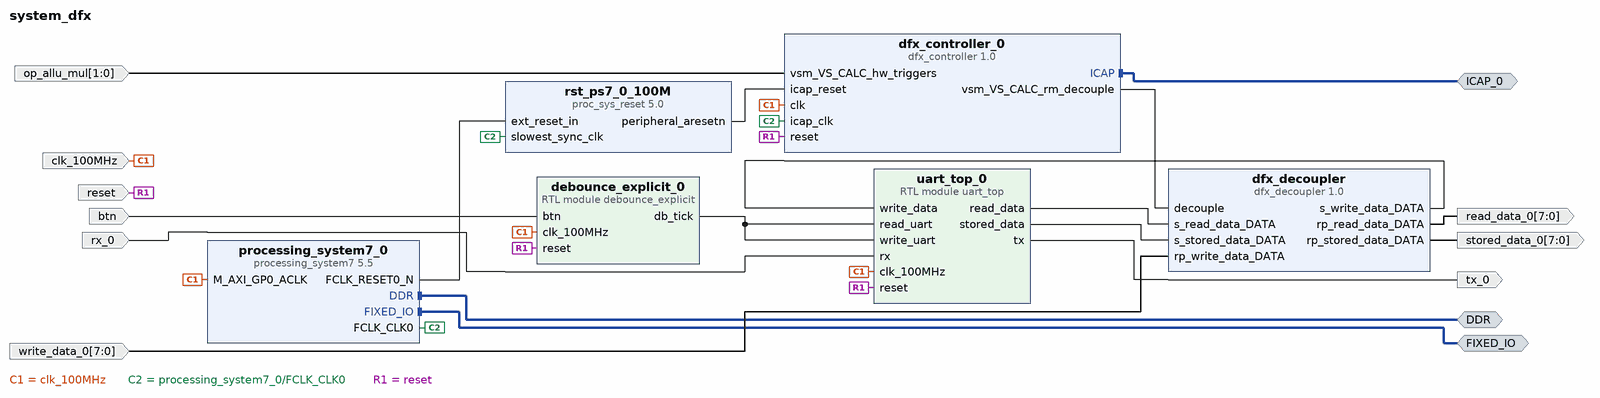
[diagram p0: block diagram of the top level]
# Vivado block design system_dfx, xc7z020clg400-1, Vivado 2024.2
create_bd_design system_dfx

create_bd_intf_port -mode Master -vlnv xilinx.com:interface:ddrx_rtl:1.0 DDR
create_bd_intf_port -mode Master -vlnv xilinx.com:display_processing_system7:fixedio_rtl:1.0 FIXED_IO
create_bd_intf_port -mode Master -vlnv xilinx.com:interface:icap_rtl:1.0 ICAP_0
create_bd_port -dir I -type rst reset
create_bd_port -dir I clk_100MHz
create_bd_port -dir I btn
create_bd_port -dir I rx_0
create_bd_port -dir I -from 7 -to 0 write_data_0
create_bd_port -dir O tx_0
create_bd_port -dir O -from 7 -to 0 read_data_0
create_bd_port -dir O -from 7 -to 0 stored_data_0
create_bd_port -dir I -from 1 -to 0 op_allu_mul

create_bd_cell -type ip -vlnv xilinx.com:ip:processing_system7:5.5 processing_system7_0
set_property -dict [list \
  CONFIG.PCW_APU_PERIPHERAL_FREQMHZ 650 \
  CONFIG.PCW_CRYSTAL_PERIPHERAL_FREQMHZ 50 \
  CONFIG.PCW_ENET0_ENET0_IO {MIO 16 .. 27} \
  CONFIG.PCW_ENET0_GRP_MDIO_ENABLE 1 \
  CONFIG.PCW_ENET0_GRP_MDIO_IO {MIO 52 .. 53} \
  CONFIG.PCW_ENET0_PERIPHERAL_ENABLE 1 \
  CONFIG.PCW_ENET0_RESET_ENABLE 1 \
  CONFIG.PCW_ENET0_RESET_IO {MIO 9} \
  CONFIG.PCW_ENET_RESET_ENABLE 1 \
  CONFIG.PCW_ENET_RESET_SELECT {Share reset pin} \
  CONFIG.PCW_FPGA0_PERIPHERAL_FREQMHZ 100 \
  CONFIG.PCW_FPGA1_PERIPHERAL_FREQMHZ 50 \
  CONFIG.PCW_GPIO_MIO_GPIO_ENABLE 1 \
  CONFIG.PCW_GPIO_MIO_GPIO_IO MIO \
  CONFIG.PCW_I2C_RESET_ENABLE 1 \
  CONFIG.PCW_M_AXI_GP0_FREQMHZ 10 \
  CONFIG.PCW_PERIPHERAL_BOARD_PRESET None \
  CONFIG.PCW_PRESET_BANK1_VOLTAGE {LVCMOS 1.8V} \
  CONFIG.PCW_QSPI_GRP_FBCLK_ENABLE 1 \
  CONFIG.PCW_QSPI_GRP_FBCLK_IO {MIO 8} \
  CONFIG.PCW_QSPI_GRP_SINGLE_SS_ENABLE 1 \
  CONFIG.PCW_QSPI_GRP_SINGLE_SS_IO {MIO 1 .. 6} \
  CONFIG.PCW_QSPI_PERIPHERAL_ENABLE 1 \
  CONFIG.PCW_QSPI_QSPI_IO {MIO 1 .. 6} \
  CONFIG.PCW_SD0_GRP_CD_ENABLE 1 \
  CONFIG.PCW_SD0_GRP_CD_IO {MIO 47} \
  CONFIG.PCW_SD0_GRP_WP_ENABLE 0 \
  CONFIG.PCW_SD0_PERIPHERAL_ENABLE 1 \
  CONFIG.PCW_SD0_SD0_IO {MIO 40 .. 45} \
  CONFIG.PCW_SDIO_PERIPHERAL_FREQMHZ 50 \
  CONFIG.PCW_SINGLE_QSPI_DATA_MODE x4 \
  CONFIG.PCW_UART0_PERIPHERAL_ENABLE 1 \
  CONFIG.PCW_UART0_UART0_IO {MIO 14 .. 15} \
  CONFIG.PCW_UART1_PERIPHERAL_ENABLE 0 \
  CONFIG.PCW_UART_PERIPHERAL_FREQMHZ 100 \
  CONFIG.PCW_UIPARAM_DDR_BUS_WIDTH {16 Bit} \
  CONFIG.PCW_UIPARAM_DDR_FREQ_MHZ 525 \
  CONFIG.PCW_UIPARAM_DDR_PARTNO {MT41J256M16 RE-125} \
  CONFIG.PCW_USB0_PERIPHERAL_ENABLE 1 \
  CONFIG.PCW_USB0_RESET_ENABLE 1 \
  CONFIG.PCW_USB0_RESET_IO {MIO 46} \
  CONFIG.PCW_USB0_USB0_IO {MIO 28 .. 39} \
  CONFIG.PCW_USB_RESET_ENABLE 1 \
  CONFIG.PCW_USB_RESET_SELECT {Share reset pin} \
] [get_bd_cells processing_system7_0]
# 481 more settings of processing_system7_0 are not shown: defaults, MIO pin electricals, DDR timing, and values the tool derives
create_bd_cell -type ip -vlnv xilinx.com:ip:dfx_decoupler:1.0 dfx_decoupler
set_property -dict [list \
  CONFIG.ALL_PARAMS {['INTF {', 'read_data {ID 0 VLNV xilinx.com:signal:data_rtl:1.0 SIGNALS {DATA {MANAGEMENT manual WIDTH 8}} MODE slave} stored_data {ID 1 VLNV xilinx.com:signal:data_rtl:1.0 MODE slave SIGNALS {DATA {MANAGEMENT', 'manual WIDTH 8}}} write_data {ID 2 VLNV xilinx.com:signal:data_rtl:1.0 SIGNALS {DATA {MANAGEMENT manual WIDTH 8}}}', '}']} \
  CONFIG.GUI_INTERFACE_NAME read_data \
  CONFIG.GUI_SELECT_VLNV xilinx.com:signal:data_rtl:1.0 \
  CONFIG.GUI_SIGNAL_MANAGEMENT_0 manual \
  CONFIG.GUI_SIGNAL_WIDTH_0 8 \
] [get_bd_cells dfx_decoupler]
create_bd_cell -type ip -vlnv xilinx.com:ip:dfx_controller:1.0 dfx_controller_0
set_property -dict [list \
  CONFIG.ALL_PARAMS {['HAS_AXI_LITE_IF 1', 'RESET_ACTIVE_LEVEL 0', 'CP_FIFO_DEPTH 32', 'CP_FIFO_TYPE lutram', 'CDC_STAGES 6', 'VS {', 'VS_CALC {ID 0 NAME VS_CALC RM {RM_ALU {ID 0 NAME RM_ALU BS {0 {ID 0 ADDR 0 SIZE 0 CLEAR 0}} RESET_REQUIRED no} RM_MUL {ID 1 NAME RM_MUL BS {0 {ID 0 ADDR 0 SIZE 0 CLEAR 0}}}} POR_RM RM_ALU', 'START_IN_SHUTDOWN 1 RMS_ALLOCATED 4 NUM_HW_TRIGGERS 2 TRIGGER_TO_RM {0 RM_ALU 1 RM_MUL}}', '}', 'CP_FAMILY 7series', 'DIRTY 1']} \
  CONFIG.GUI_LOCK_TRIGGER_0 true \
  CONFIG.GUI_LOCK_TRIGGER_1 true \
  CONFIG.GUI_RM_NEW_NAME RM_MUL \
  CONFIG.GUI_RM_RESET_REQUIRED no \
  CONFIG.GUI_SELECT_RM 1 \
  CONFIG.GUI_VS_NEW_NAME VS_CALC \
  CONFIG.GUI_VS_NUM_HW_TRIGGERS 2 \
] [get_bd_cells dfx_controller_0]
create_bd_cell -type ip -vlnv xilinx.com:ip:proc_sys_reset:5.0 rst_ps7_0_100M
create_bd_cell -type module -reference debounce_explicit debounce_explicit_0
create_bd_cell -type module -reference uart_top uart_top_0

# ---- connections ----

connect_bd_intf_net [get_bd_intf_ports ICAP_0] [get_bd_intf_pins dfx_controller_0/ICAP]
connect_bd_intf_net [get_bd_intf_ports DDR] [get_bd_intf_pins processing_system7_0/DDR]
connect_bd_intf_net [get_bd_intf_ports FIXED_IO] [get_bd_intf_pins processing_system7_0/FIXED_IO]
connect_bd_net [get_bd_ports btn] [get_bd_pins debounce_explicit_0/btn]
connect_bd_net -net clk_100MHz_0_1 [get_bd_ports clk_100MHz] \
  [get_bd_pins processing_system7_0/M_AXI_GP0_ACLK] [get_bd_pins dfx_controller_0/clk] [get_bd_pins uart_top_0/clk_100MHz] \
  [get_bd_pins debounce_explicit_0/clk_100MHz]
connect_bd_net [get_bd_pins debounce_explicit_0/db_tick] [get_bd_pins uart_top_0/read_uart] [get_bd_pins uart_top_0/write_uart]
connect_bd_net [get_bd_pins dfx_controller_0/vsm_VS_CALC_rm_decouple] [get_bd_pins dfx_decoupler/decouple]
connect_bd_net [get_bd_pins dfx_decoupler/rp_read_data_DATA] [get_bd_ports read_data_0]
connect_bd_net [get_bd_pins dfx_decoupler/rp_stored_data_DATA] [get_bd_ports stored_data_0]
connect_bd_net [get_bd_pins dfx_decoupler/s_write_data_DATA] [get_bd_pins uart_top_0/write_data]
connect_bd_net [get_bd_pins processing_system7_0/FCLK_CLK0] [get_bd_pins dfx_controller_0/icap_clk] [get_bd_pins rst_ps7_0_100M/slowest_sync_clk]
connect_bd_net [get_bd_pins processing_system7_0/FCLK_RESET0_N] [get_bd_pins rst_ps7_0_100M/ext_reset_in]
connect_bd_net -net reset_0_1 [get_bd_ports reset] \
  [get_bd_pins dfx_controller_0/reset] [get_bd_pins uart_top_0/reset] [get_bd_pins debounce_explicit_0/reset]
connect_bd_net [get_bd_pins rst_ps7_0_100M/peripheral_aresetn] [get_bd_pins dfx_controller_0/icap_reset]
connect_bd_net -net rx_0_1 [get_bd_ports rx_0] [get_bd_pins uart_top_0/rx]
connect_bd_net [get_bd_pins uart_top_0/read_data] [get_bd_pins dfx_decoupler/s_read_data_DATA]
connect_bd_net [get_bd_pins uart_top_0/stored_data] [get_bd_pins dfx_decoupler/s_stored_data_DATA]
connect_bd_net [get_bd_pins uart_top_0/tx] [get_bd_ports tx_0]
connect_bd_net -net vsm_VS_CALC_hw_triggers_0_1 [get_bd_ports op_allu_mul] [get_bd_pins dfx_controller_0/vsm_VS_CALC_hw_triggers]
connect_bd_net -net write_data_0_1 [get_bd_ports write_data_0] [get_bd_pins dfx_decoupler/rp_write_data_DATA]

validate_bd_design
save_bd_design
